# EAGLE design NodeMCU_Watering_System_III (EAGLE 9.0.0)
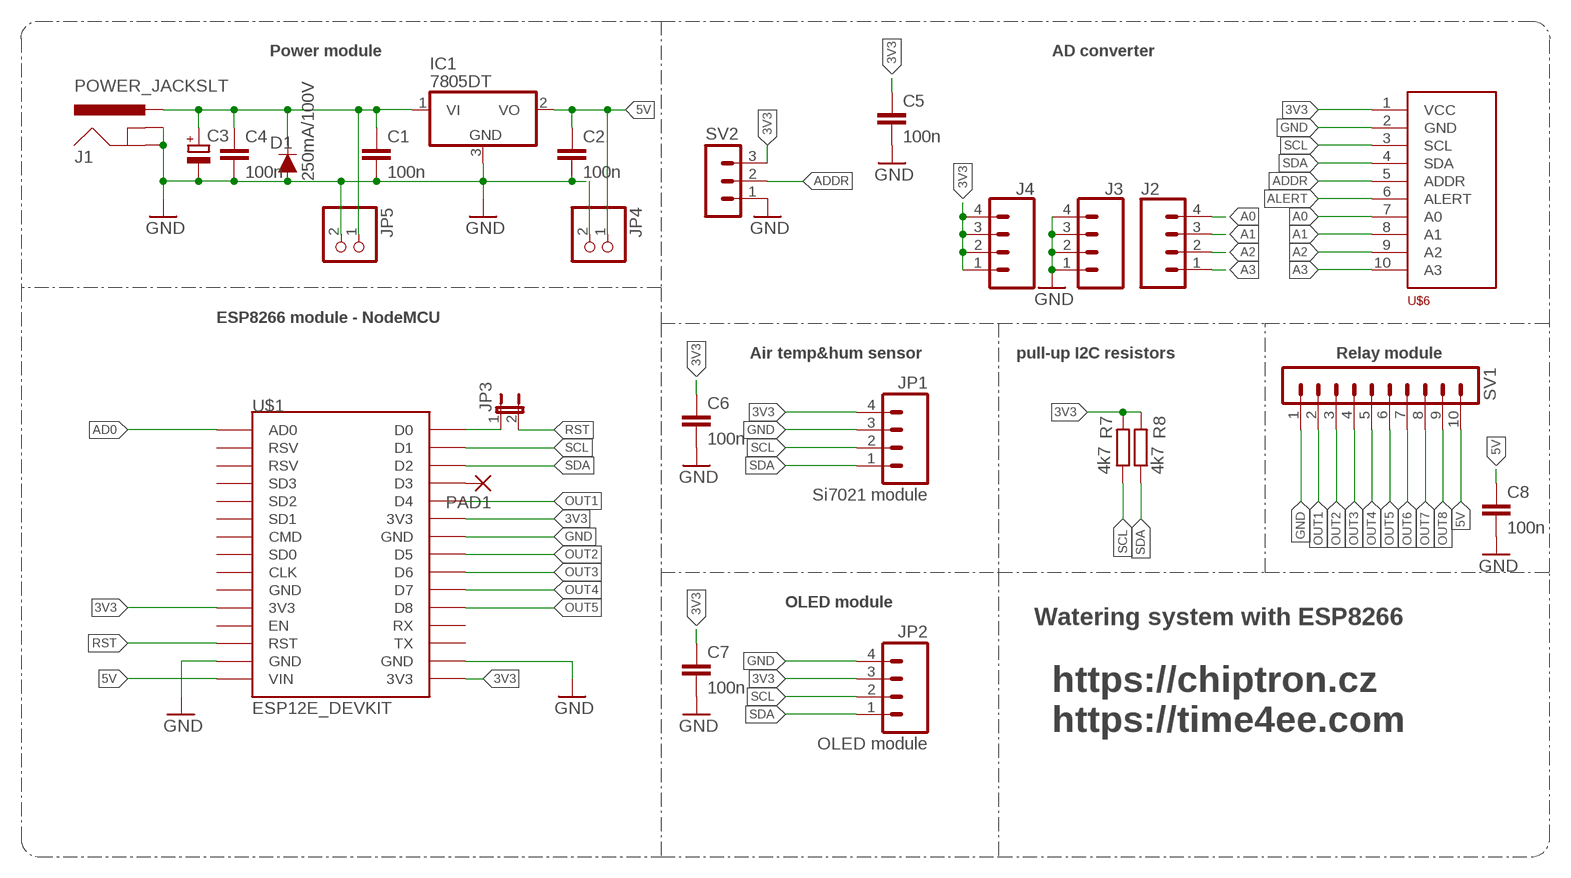
[diagram p0: schematic, sheet 1]

## Parts
C1  100n  C-EUC0805K  [C0805K]
C2  100n  C-EUC0805K  [C0805K]
C3  CPOL-EUB/3528-21W  [B/3528-21W]
C4  100n  C-EUC0805K  [C0805K]
C5  100n  C-EUC0805K  [C0805K]
C6  100n  C-EUC0805K  [C0805K]
C7  100n  C-EUC0805K  [C0805K]
C8  100n  C-EUC0805K  [C0805K]
D1  250mA/100V  DIODE-BAS16J  [SOD-323]
IC1  7805DT  [TO252]
J1  POWER_JACKSLT  [POWER_JACK_SLOT]
J2  CONN_04  [1X04]
J3  CONN_04  [1X04]
J4  CONN_04  [1X04]
JP1  Si7021 module  M04LONGPADS  [1X04_LONGPADS]
JP2  OLED module  M04LONGPADS  [1X04_LONGPADS]
JP3  JP1E  [JP1]
JP4  PINHD-1X2  [1X02]
JP5  PINHD-1X2  [1X02]
PAD1  1,6/0,8  [1,6/0,8]
R7  4k7  R-EU_M0805  [M0805]
R8  4k7  R-EU_M0805  [M0805]
SV1  MA10-1  [MA10-1]
SV2  MA03-1  [MA03-1]
U$1  ESP12E_DEVKIT  [ESP12E_DEVKIT]
U$6  ADS1115_BOARD  [ADS1115_ADS]

## Nets
3V3: C5.1 C6.1 C7.1 J4.1 J4.2 J4.3 J4.4 JP1.4 JP2.3 R7.2 R8.2 SV2.3 U$1.3V3@0(3V3) U$1.3V3@1(3V3) U$1.3V3@2(3V3) U$6.1(VCC)
5V: C2.1 C8.1 IC1.2(VO) JP4.1 SV1.10 U$1.VIN
A0: J2.4 U$6.7(A0)
A1: J2.3 U$6.8(A1)
A2: J2.2 U$6.9(A2)
A3: J2.1 U$6.10(A3)
AD0: U$1.AD0
ADDR: SV2.2 U$6.5(ADDR)
ALERT: U$6.6(ALERT)
GND: C1.2 C2.2 C3.- C4.2 C5.2 C6.2 C7.2 C8.2 D1.A IC1.3(GND) J1.GND@1(GNDBREAK) J1.GND@2(GND) J3.1 J3.2 J3.3 J3.4 JP1.3 JP2.4 JP4.2 JP5.2 SV1.1 SV2.1 U$1.GND@1(GND) U$1.GND@2(GND) U$1.GND@3(GND) U$6.2(GND)
N$1: JP3.1 U$1.D0
N$2: PAD1.1(P) U$1.D3
OUT1: SV1.2 U$1.D4
OUT2: SV1.3 U$1.D5
OUT3: SV1.4 U$1.D6
OUT4: SV1.5 U$1.D7
OUT5: SV1.6 U$1.D8
OUT6: SV1.7
OUT7: SV1.8
OUT8: SV1.9
RST: JP3.2 U$1.RST
SCL: JP1.2 JP2.2 R7.1 U$1.D1 U$6.3(SCL)
SDA: JP1.1 JP2.1 R8.1 U$1.D2 U$6.4(SDA)
VIN: C1.1 C3.+ C4.1 D1.C IC1.1(VI) J1.PWR JP5.1
Unconnected: U$1.CLK U$1.CMD U$1.EN U$1.GND@0(GND) U$1.RSV@0(RSV) U$1.RSV@1(RSV) U$1.RX U$1.SD0 U$1.SD1 U$1.SD2 U$1.SD3 U$1.TX

## Notes on the sheet
- Power module | AD converter
- ESP8266 module - NodeMCU
- Air temp&hum sensor | pull-up I2C resistors | Relay module
- OLED module
- Watering system with ESP8266
- https://chiptron.cz
  https://time4ee.com

## Library data of the parts
C1 C2 C4-C8 = rcl:C-EU: CAPACITOR, European symbol
C3 = rcl:CPOL-EU: POLARIZED CAPACITOR, European symbol; SPICEPREFIX: C
D1 = SparkFun-DiscreteSemi:DIODE: Diode These are standard reverse protection diodes and small signal diodes. SparkFun Products: SparkFun SparkPunk Sound Kit <https://www.sparkfun.com/products/11177> SparkFun ESP8266 Thing <https://www.sparkfun.com/products/13231>; PROD_ID: DIO-09646
IC1 = linear:78*: Positive VOLTAGE REGULATOR Source: http://cache.national.com/ds/LM/LM78L05.pdf http://www.fairchildsemi.com/ds/LM/LM7805.pdf
J1 = SparkFun-Connectors:POWER_JACK: Power Jack Connector This is the standard 5.5mm barrel jack for power. The PTH is the most common, proven, reliable, footprint. The Slot footprint only works if the mill layer is transmitted to the PCB fab house so be warned. Here are the connectors we sell at SparkFun: DC Barrel Power Jack/Connector <https://www.sparkfun.com/products/119> (PRT-00119) DC Barrel Power Jack/Connector (SMD) <https://www.sparkfun.com/products/12748> (PRT-12748) DC Barrel Jack Adapter - Breadboard Compatible <https://www.sparkfun.com/products/10811> (PRT-10811) It is used on this SparkFun product (and many, many others): SparkFun RedBoard - Programmed with Arduino <https://www.sparkfun.com/products/12757> (DEV-12757) Also, if you need a mating power supply or connector, please check these out: Wall Adapter Power Supply - 9VDC 650mA <https://www.sparkfun.com/products/298> (TOL-00298) DC Barrel Jack Adapter - Male <https://www.sparkfun.com/products/10287> (PRT-10287); PROD_ID: PRT-00119
J2-J4 = SparkFun-Connectors:CONN_04: Multi connection point. Often used as Generic Header-pin footprint for 0.1 inch spaced/style header connections On any of the 0.1 inch spaced packages, you can populate with these: Break Away Headers - Straight <https://www.sparkfun.com/products/116> (PRT-00116) Break Away Male Headers - Right Angle <https://www.sparkfun.com/products/553> (PRT-00553) Female Headers <https://www.sparkfun.com/products/115> (PRT-00115) Break Away Headers - Machine Pin <https://www.sparkfun.com/products/117> (PRT-00117) Break Away Female Headers - Swiss Machine Pin <https://www.sparkfun.com/products/743> (PRT-00743) For SCREWTERMINALS and SPRING TERMINALS visit here: Screw Terimnals on SparkFun.com <https://www.sparkfun.com/search/results?term=Screw+Terminals> (5mm/3.5mm/2.54mm spacing) This device is also useful as a general connection point to wire up your design to another part of your project. Our various solder wires solder well into these plated through hole pads. Hook-Up Wire - Assortment (Stranded, 22 AWG) <https://www.sparkfun.com/products/11375> (PRT-11375) Hook-Up Wire - Assortment (Solid Core, 22 AWG) <https://www.sparkfun.com/products/11367> (PRT-11367) View the entire wire category on our website here <https://www.sparkfun.com/categories/141> Special notes: Molex polarized connector foot print use with SKU : PRT-08231 with associated crimp pins and housings. 1MM SMD Version SKU: PRT-10208; PROD_ID: CONN-09696
JP1 JP2 = SparkFun:M04: Header 4 Standard 4-pin 0.1" header. Use with straight break away headers (SKU : PRT-00116), right angle break away headers (PRT-00553), swiss pins (PRT-00743), machine pins (PRT-00117), and female headers (PRT-00115). Molex polarized connector foot print use with SKU : PRT-08231 with associated crimp pins and housings. 1MM SMD Version SKU: PRT-10208
JP3 = jumper:JP1E: JUMPER
JP4 JP5 = pinhead:PINHD-1X2: PIN HEADER
PAD1 = wirepad:1,6/0,8: THROUGH-HOLE PAD
R7 R8 = rcl:R-EU_: RESISTOR, European symbol
SV1 = con-lstb:MA10-1: PIN HEADER; OC_FARNELL: unknown; OC_NEWARK: unknown
SV2 = con-lstb:MA03-1: PIN HEADER; OC_FARNELL: unknown; OC_NEWARK: unknown
U$1 = NodeMCU:ESP12E_DEVKIT: ESP12E DEVKIT BOARD
U$6 = chiptron_petus_cz:ADS1115_BOARD: Board with ADS1115 ADC which is compatible with chinese boards

## Board
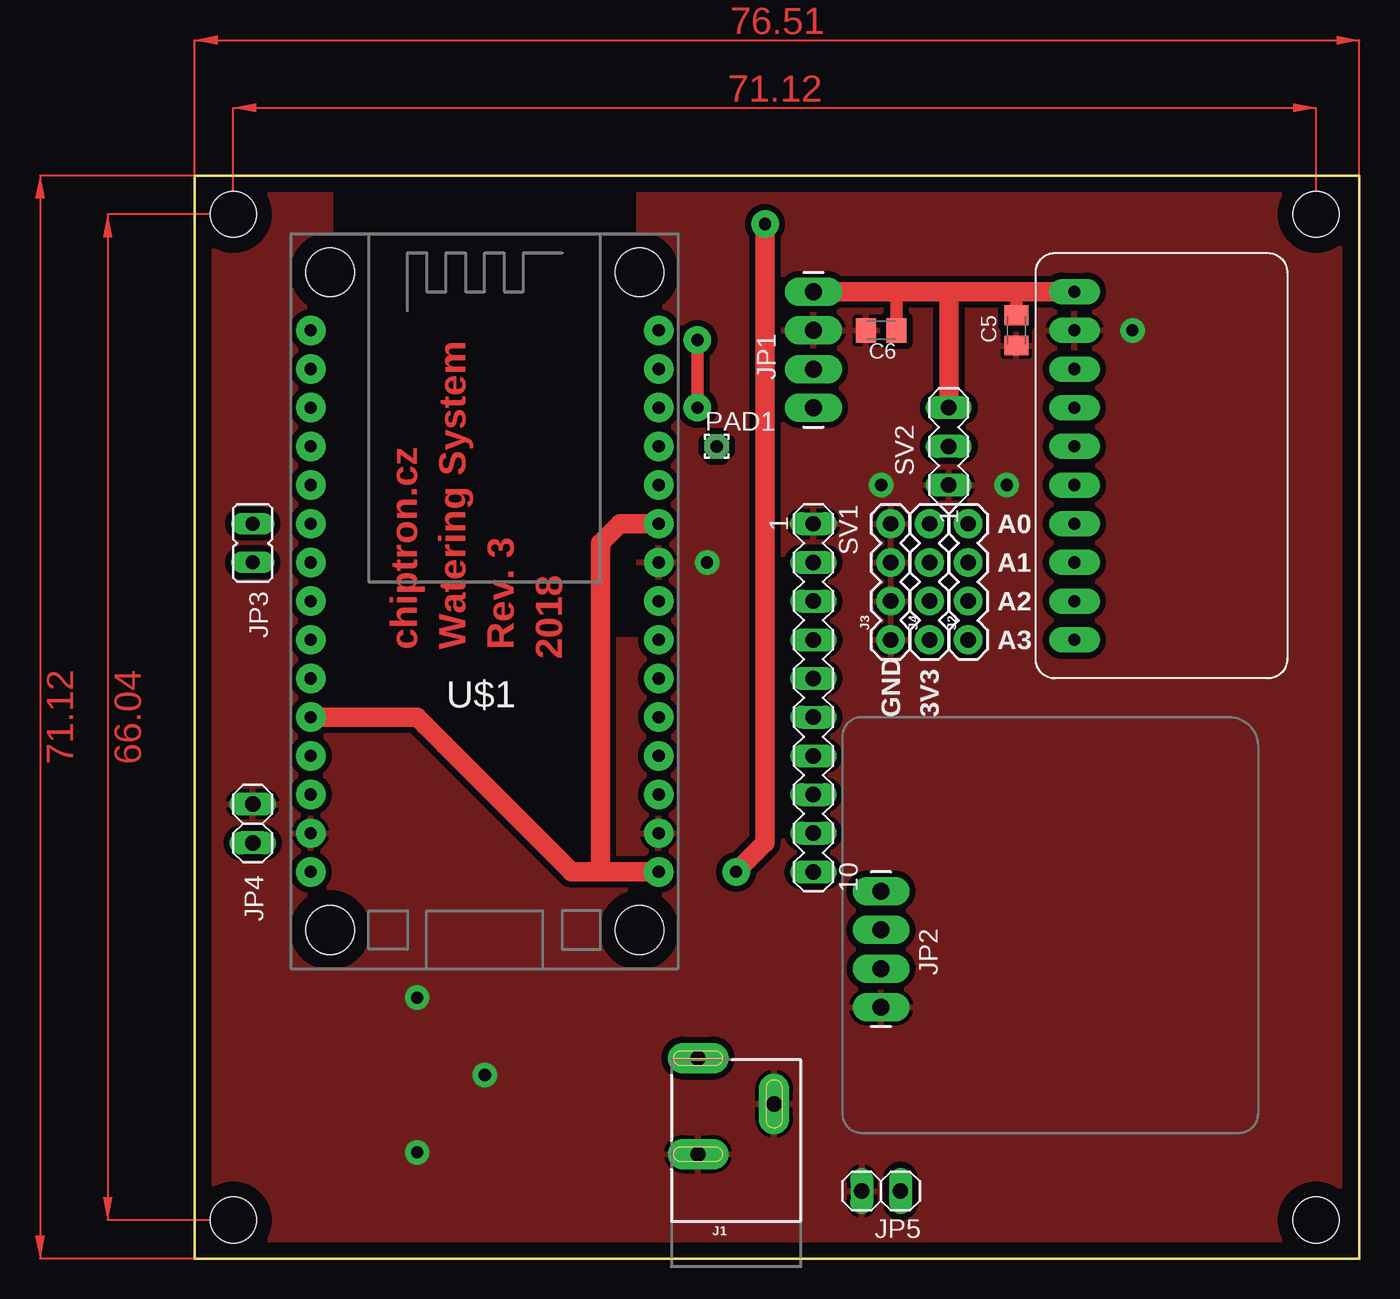
[diagram p1: board, top side]
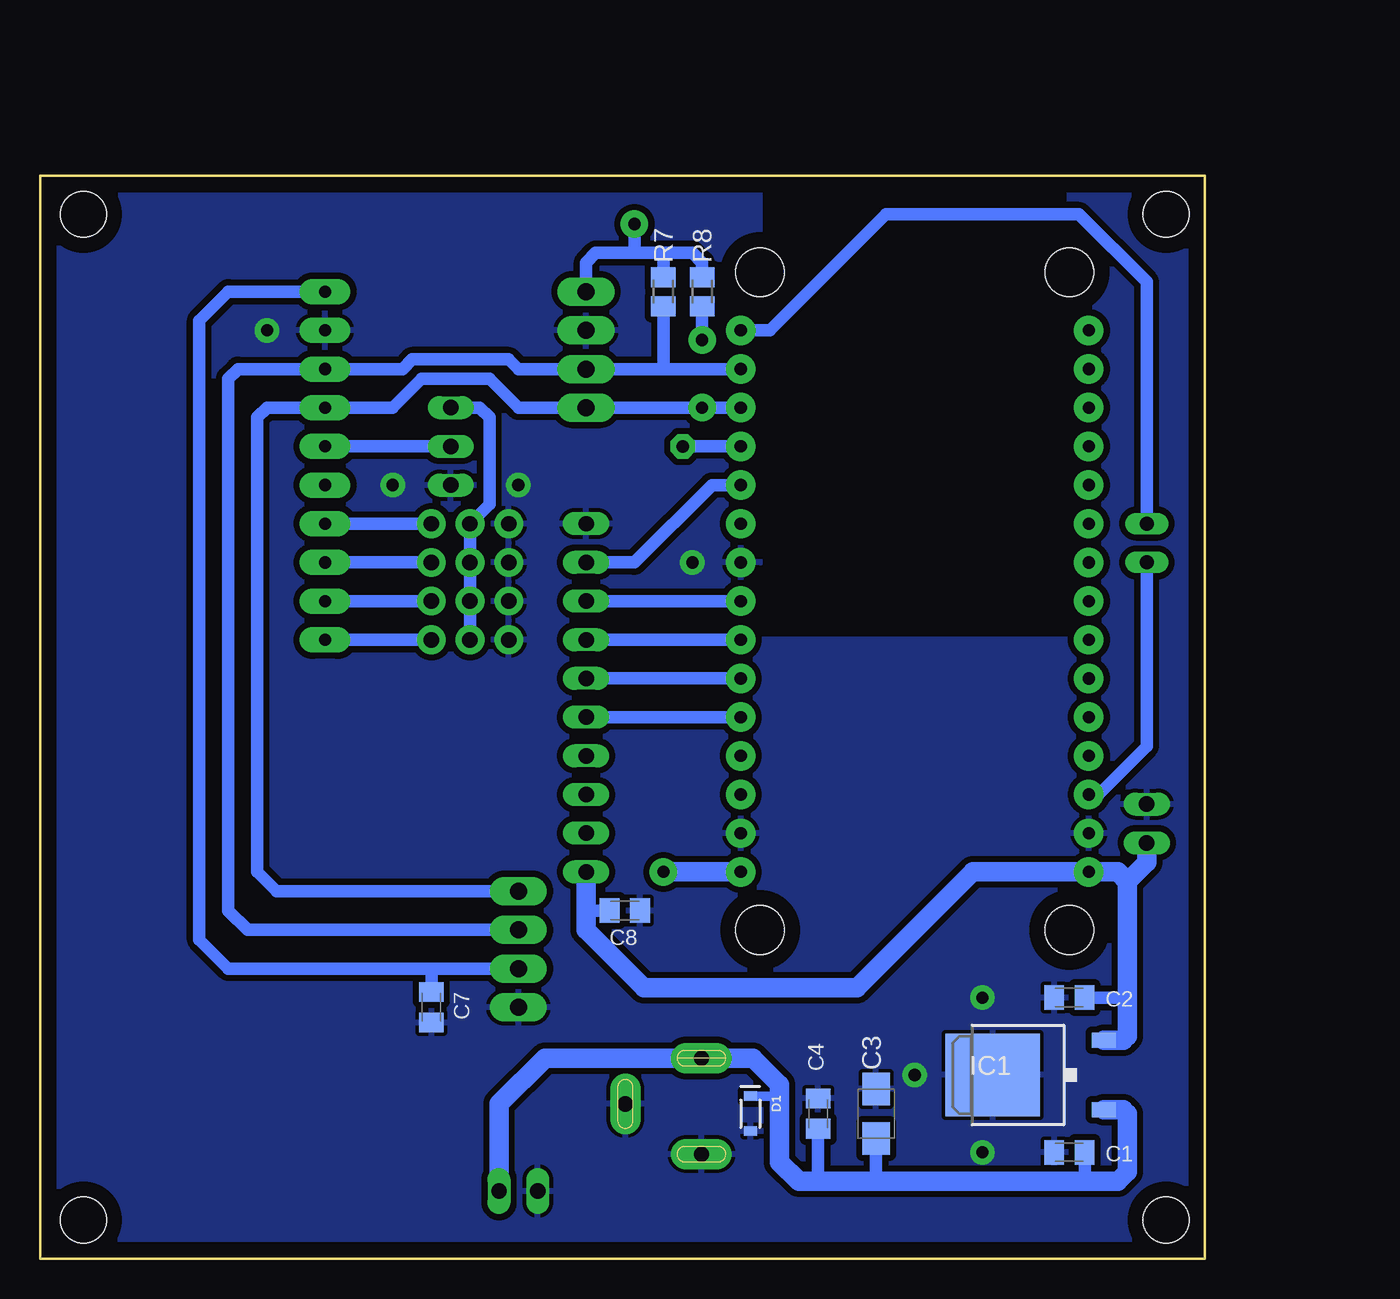
[diagram p2: board, bottom side, seen from below]

Size 76.51 x 71.11 mm. Coordinates in mm from the lower left corner, seen from the top.
Outline: 0,0 76.51,0 76.51,71.11 0,71.11 0,0
Copper layers (1*16): Top 0.035mm / dielectric 1.5mm / Bottom 0.035mm
Design rules "default": minimum track width 10mil, minimum drill 24mil, track to track 8mil, track to pad 8mil, pad to pad 8mil, via to via 8mil, smd to smd 8mil, copper to edge 40mil, drill to drill 8mil, minimum pad ring 10mil, minimum via ring 8mil, stop-mask expansion 4mil, vias tented up to drill 0mil, thermal gap 10mil
Holes 3 mm at 2.54,2.54 73.66,2.54 73.66,68.58 2.54,68.58

### Footprints (pad centres in the part's own frame; a part is rotated, then mirrored left to right if it is on the bottom)
C0805K = smd 1.3 x 1.6: 1 -1,0; 2 1,0
B/3528-21W = smd 2.15 x 1.8: + 1.625,0; - -1.625,0
SOD-323 = smd 0.63 x 0.83: A 1.15,0; C -1.15,0
TO252 = smd 1 x 1.6: 1 -2.28,-4.8; 2 2.28,-4.8 | smd 5.4 x 6.2: 3 0,2.5
POWER_JACK_SLOT = drill 1 pad 2 long: GND@1 2.58,7.5; GND@2 7.58,10.8; PWR 2.58,13.8
1X04 = drill 1.016 pad 1.88: 1 0,0; 2 2.54,0; 3 5.08,0; 4 7.62,0
1X04_LONGPADS = drill 1.118 pad 1.88 long: 1 0,0; 2 2.54,0; 3 5.08,0; 4 7.62,0
JP1 = drill 0.914 long: 1 0,-1.27; 2 0,1.27
1X02 = drill 1.016 long: 1 -1.27,0; 2 1.27,0
1,6/0,8 = drill 0.813 pad 1.6 octagon: 1 0,0
M0805 = smd 1.3 x 1.6: 1 -0.95,0; 2 0.95,0
MA10-1 = drill 1.016 long: 1 -11.43,0; 2 -8.89,0; 3 -6.35,0; 4 -3.81,0; 5 -1.27,0; 6 1.27,0; 7 3.81,0; 8 6.35,0; 9 8.89,0; 10 11.43,0
MA03-1 = drill 1.016 long: 1 -2.54,0; 2 0,0; 3 2.54,0
ESP12E_DEVKIT = drill 0.8 pad 1.93: 3V3@0 -11.43,-7.62; 3V3@1 11.43,5.08; 3V3@2 11.43,-17.78; AD0 -11.43,17.78; CLK -11.43,-2.54; CMD -11.43,2.54; D0 11.43,17.78; D1 11.43,15.24; D2 11.43,12.7; D3 11.43,10.16; D4 11.43,7.62; D5 11.43,0; D6 11.43,-2.54; D7 11.43,-5.08; D8 11.43,-7.62; EN -11.43,-10.16; GND@0 -11.43,-5.08; GND@1 -11.43,-15.24; GND@2 11.43,2.54; GND@3 11.43,-15.24; RST -11.43,-12.7; RSV@0 -11.43,15.24; RSV@1 -11.43,12.7; RX 11.43,-10.16; SD0 -11.43,0; SD1 -11.43,5.08; SD2 -11.43,7.62; SD3 -11.43,10.16; TX 11.43,-12.7; VIN -11.43,-17.78 | hole 3.2: -10.16,21.59; 10.16,21.59; 10.16,-21.59; -10.16,-21.59
ADS1115_ADS = drill 0.8 pad 1.676 long: 1 0,0; 2 2.54,0; 3 5.08,0; 4 7.62,0; 5 10.16,0; 6 12.7,0; 7 15.24,0; 8 17.78,0; 9 20.32,0; 10 22.86,0

### Placement (x,y rotation side)
C1  8.89,6.98 180 bottom
C2  8.89,17.14 180 bottom
C3  21.59,9.52 270 bottom
C4  25.4,9.52 90 bottom
C5  53.98,60.96 270 top
C6  45.09,60.96 180 top
C7  50.8,16.51 270 bottom
C8  38.1,22.86 0 bottom
D1  29.85,9.52 270 bottom
IC1  11.43,12.06 90 bottom
J1  30.48,-0.63 0 top
J2  50.8,40.64 90 top
J3  45.72,40.64 90 top
J4  48.26,40.64 90 top
JP1  40.64,55.88 90 top
JP2  45.09,24.13 270 top
JP3  3.81,46.99 180 top
JP4  3.81,28.58 90 top
JP5  45.09,4.45 180 top
PAD1  34.29,53.34 0 top
R7  35.56,63.5 90 bottom
R8  33.02,63.5 90 bottom
SV1  40.64,36.83 270 top
SV2  49.53,53.34 90 top
U$1  19.05,43.18 0 top
U$6  57.78,63.5 270 top

### Tracks (layer width: path | path; a pad name or v marks a point on that pad's centre or on a via)
3V3  (via drill 0.8 pad 1.8)
  Top 0.813: C5.1 53.98,63.5 | C6.1 46.09,63.14 45.72,63.5
  Top 1.27: U$6.1 53.98,63.5 49.53,63.5 | 49.53,63.5 45.72,63.5 JP1.4 | SV2.3 49.53,63.5 | v37.46,67.94 37.46,27.3 v35.56,25.4 | 26.67,25.4 24.77,25.4 16.41,33.76 15.14,35.04 14.62,35.56 U$1.3V3@0 | 26.67,25.4 U$1.3V3@2 | U$1.3V3@1 27.94,48.26 26.67,46.99 26.67,25.4
  Bottom 0.813: JP1.4 40.64,65.41 40,66.04 37.46,66.04 | 37.46,66.04 35.56,66.04 | 35.56,66.04 33.66,66.04 33.02,65.41 R8.2 | 37.46,66.04 v37.46,67.94 | JP2.3 50.8,19.05 | 50.8,19.05 64.14,19.05 66.04,20.95 66.04,61.59 64.14,63.5 U$6.1 | J4.1 J4.2 J4.3 J4.4 46.99,49.53 46.99,55.25 47.62,55.88 SV2.3 | R7.2 35.56,66.04 | C7.1 50.8,19.05
  Bottom 1.27: v35.56,25.4 U$1.3V3@2
5V
  Bottom 0.813: C2.1 5.08,17.14 | C8.1 40.64,22.86
  Bottom 1.27: 5.08,24.77 5.71,25.4 U$1.VIN 15.24,25.4 22.86,17.78 36.83,17.78 40.64,21.59 40.64,22.86 SV1.10 | 5.08,24.77 5.08,17.14 5.08,14.61 5.34,14.34 IC1.2 | JP4.1 3.81,26.03 5.08,24.77
A0
  Bottom 0.813: U$6.7 J2.4
A1
  Bottom 0.813: U$6.8 J2.3
A2
  Bottom 0.813: U$6.9 J2.2
A3
  Bottom 0.813: U$6.10 J2.1
ADDR
  Bottom 0.813: U$6.5 SV2.2
GND  (via drill 0.8 pad 1.6)
  other vias: 61.59,60.96 53.34,50.8 45.09,50.8 33.66,45.72 14.61,17.14 19.05,12.06 14.61,6.98
  pour Bottom (isolate 0.406): 0,71.12 8.89,71.12 8.89,40.64 29.21,40.64 29.21,71.12 76.2,71.12 76.84,0 0,0
  pour Top (isolate 0.406): 0,71.12 8.89,71.12 8.89,40.64 29.21,40.64 29.21,71.12 76.2,71.12 76.84,0 0,0
N$1
  Bottom 0.813: JP3.1 3.81,64.14 8.26,68.58 20.96,68.58 28.58,60.96 U$1.D0
N$2
  Bottom 0.813: U$1.D3 PAD1.1
OUT1
  Bottom 0.813: U$1.D4 32.38,50.8 37.46,45.72 SV1.2
OUT2
  Bottom 0.813: U$1.D5 SV1.3
OUT3
  Bottom 0.813: U$1.D6 SV1.4
OUT4
  Bottom 0.813: U$1.D7 SV1.5
OUT5
  Bottom 0.813: U$1.D8 SV1.6
RST
  Bottom 0.813: U$1.RST 6.98,30.48 3.81,33.66 JP3.2
SCL
  Bottom 0.813: U$1.D1 35.56,58.42 | 35.56,58.42 JP1.2 45.09,58.42 45.72,59.05 52.07,59.05 52.7,58.42 U$6.3 63.5,58.42 64.14,57.78 64.14,22.86 62.86,21.59 JP2.2 | R7.1 35.56,58.42
SDA  (via drill 0.8 pad 1.8)
  Top 0.813: v33.02,55.88 v33.02,60.33
  Bottom 0.813: U$1.D2 v33.02,55.88 JP1.1 45.09,55.88 46.99,57.78 51.43,57.78 53.34,55.88 U$6.4 61.59,55.88 62.23,55.25 62.23,25.4 60.96,24.13 JP2.1 | R8.1 v33.02,60.33
VIN
  Bottom 0.61: D1.C 28.46,10.68 27.94,10.16
  Bottom 0.813: C3.+ 21.59,5.08 | C4.1 25.4,5.08 | C1.1 7.89,5.35 7.62,5.08
  Bottom 1.27: IC1.1 5.34,9.79 5.08,9.52 5.08,5.71 5.71,5.08 7.62,5.08 21.59,5.08 25.4,5.08 26.67,5.08 27.94,6.35 27.94,10.16 27.94,11.43 29.68,13.16 J1.PWR 43.35,13.16 46.35,10.16 JP5.1
(copper drawn outside any net)
  shapes: Top area x4

### Text on the board
Top: chiptron.cz | Watering System | Rev. 3 | 2018
tNames: A0 | A1 | A2 | A3 | GND | 3V3